# Altium project ESP32-WIRELESS.PrjPcb
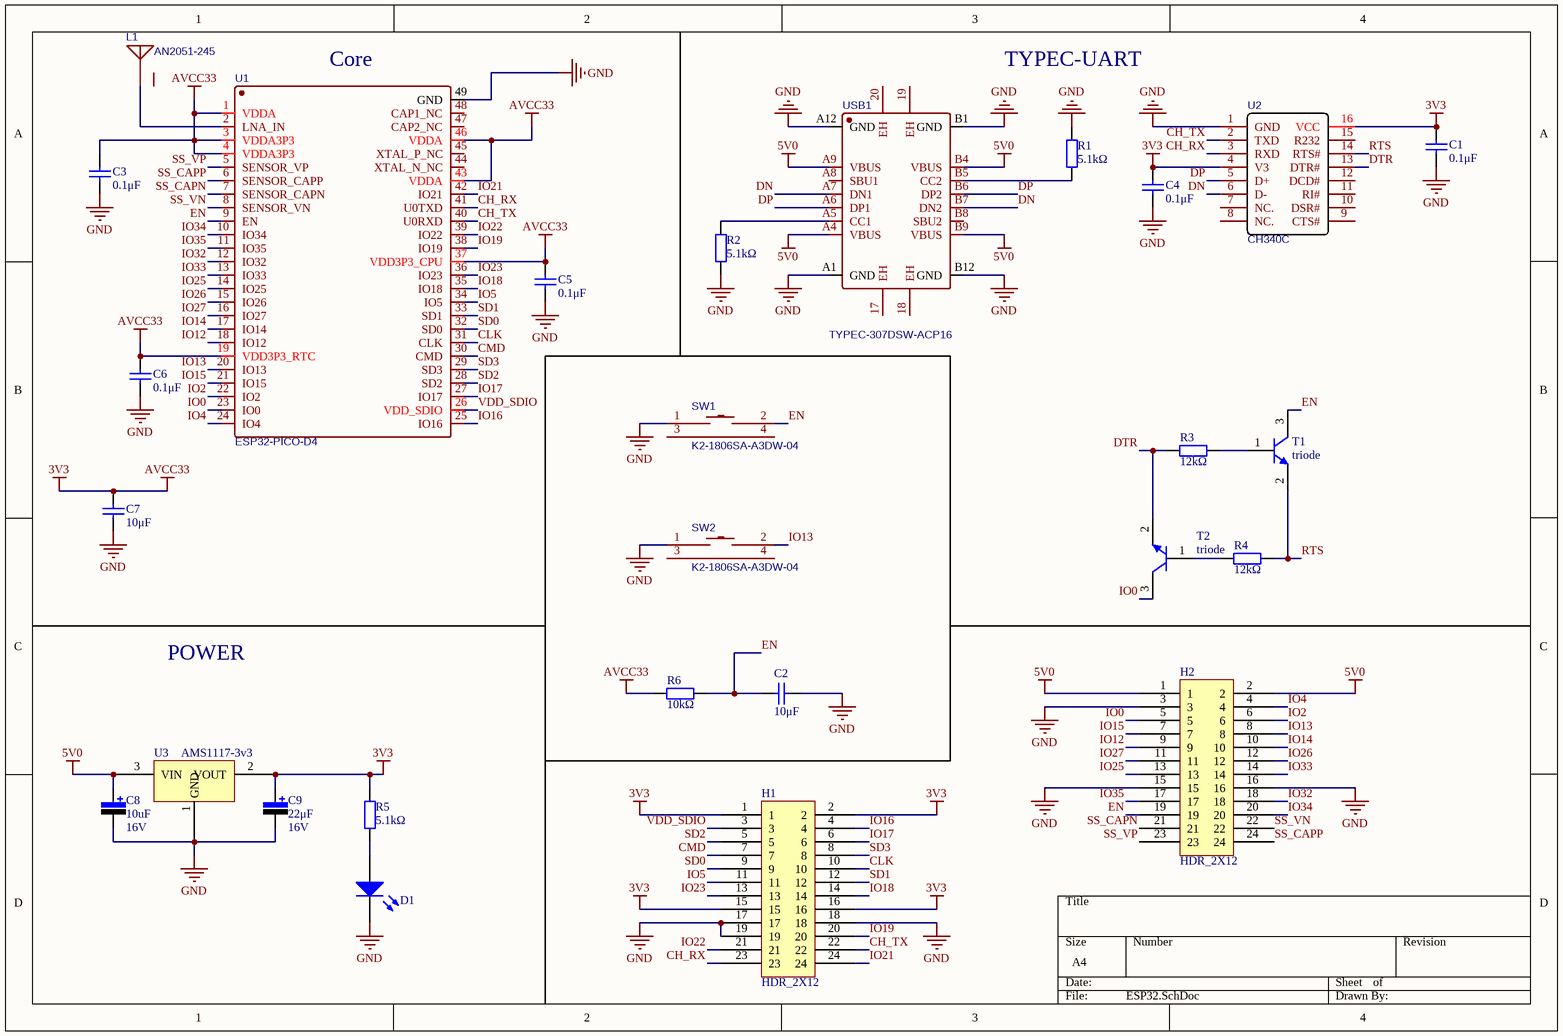
[diagram p0: ESP32.SchDoc]
1 sheet, 27 parts. Net scope: global (net labels, ports and power ports of the same name join across sheets).
Board file: ESP32.PcbDoc

## Sheet ESP32.SchDoc
size A4

### Parts
C1  value 0.1μF  [0603-C]  (hidden comment: Cap)
C2  value 10μF  [0603-C]  (hidden comment: Cap)
C3  value 0.1μF  [0603-C]  (hidden comment: Cap)
C4  value 0.1μF  [0603-C]  (hidden comment: Cap)
C5  value 0.1μF  [0603-C]  (hidden comment: Cap)
C6  value 0.1μF  [0603-C]  (hidden comment: Cap)
C7  value 10μF  [0603-C]  (hidden comment: Cap)
C8  value 10uF  Vol: 16V  [CAP-3528]  (hidden comment: Cap Pol)
C9  value 22μF  Vol: 16V  [CAP-3528]  (hidden comment: Cap Pol)
D1  LED0  [LED_0805]  (value not drawn)
H1  HDR_2X12  [HDR_2X12]
H2  HDR_2X12  [HDR_2X12]
L1  AN2051-245  [ANT2051]
R1  value 5.1kΩ  [0603_R]  (hidden comment: Res2)
R2  value 5.1kΩ  [0603_R]  (hidden comment: Res2)
R3  value 12kΩ  [0603_R]  (hidden comment: Res2)
R4  value 12kΩ  [0603_R]  (hidden comment: Res2)
R5  value 5.1kΩ  [0603_R]  (hidden comment: Res2)
R6  value 10kΩ  [0603_R]  (hidden comment: Res2)
SW1  K2-1806SA-A3DW-04  [KEY-SMD_K2-1806SA-AXXW-XX]
SW2  K2-1806SA-A3DW-04  [KEY-SMD_K2-1806SA-AXXW-XX]
T1  triode  [SOT-23-3三极管贴片]
T2  triode  [SOT-23-3三极管贴片]
U1  ESP32-PICO-D4  [QFN-48_L7.0-W7.0-P0.50-BL-EP5.4]
U2  CH340C  [SOP-16_L10.0-W3.9-P1.27-LS6.0-BL]
U3  AMS1117-3v3  [SOT-223]
USB1  TYPEC-307DSW-ACP16  [USB-C-SMD_TYPEC-307DSW-ACP16]

### Nets
3V3: C1.1 C3.1 C4.1 C5.1 C6.1 C7.1 C9.1 H1.1 H1.2 H1.15 H1.16 R5.2 R6.1 U1.1(VDDA) U1.3(VDDA3P3) U1.4(VDDA3P3) U1.19(VDD3P3_RTC) U1.37(VDD3P3_CPU) U1.43(VDDA) U1.46(VDDA) U2.4(V3) U2.16(VCC) U3.2(VOUT)  [also labelled AVCC33]
5V0: C8.1 H2.1 H2.2 U3.3(VIN) USB1.A4(VBUS) USB1.A9(VBUS) USB1.B4(VBUS) USB1.B9(VBUS)
GND: C1.2 C2.2 C3.2 C4.2 C5.2 C6.2 C7.2 C8.2 C9.2 D1.2(K) H1.17 H1.18 H1.19 H2.3 H2.15 H2.16 R1.1 R2.2 SW1.1 SW2.1 U1.49(GND) U2.1(GND) U3.1(GND) USB1.A1(GND) USB1.A12(GND) USB1.B1(GND) USB1.B12(GND)
CH_RX: H1.23 U1.41(U0TXD) U2.3(RXD)
CH_TX: H1.22 U1.40(U0RXD) U2.2(TXD)
CLK: H1.10 U1.31(CLK)
CMD: H1.7 U1.30(CMD)
DN: U2.6(D-) USB1.A7(DN1) USB1.B7(DN2)
DP: U2.5(D+) USB1.A6(DP1) USB1.B6(DP2)
DTR: R3.1 T2.2(E) U2.13(DTR#)
EN: C2.1 H2.19 R6.2 SW1.2 T1.3(C) U1.9(EN)
IO0: H2.5 T2.3(C) U1.23(IO0)
IO2: H2.6 U1.22(IO2)
IO4: H2.4 U1.24(IO4)
IO5: H1.11 U1.34(IO5)
IO12: H2.9 U1.18(IO12)
IO13: H2.8 SW2.2 U1.20(IO13)
IO14: H2.10 U1.17(IO14)
IO15: H2.7 U1.21(IO15)
IO16: H1.4 U1.25(IO16)
IO17: H1.6 U1.27(IO17)
IO18: H1.14 U1.35(IO18)
IO19: H1.20 U1.38(IO19)
IO21: H1.24 U1.42(IO21)
IO22: H1.21 U1.39(IO22)
IO23: H1.13 U1.36(IO23)
IO25: H2.13 U1.14(IO25)
IO26: H2.12 U1.15(IO26)
IO27: H2.11 U1.16(IO27)
IO32: H2.18 U1.12(IO32)
IO33: H2.14 U1.13(IO33)
IO34: H2.20 U1.10(IO34)
IO35: H2.17 U1.11(IO35)
RTS: R4.2 T1.2(E) U2.14(RTS#)
SD0: H1.9 U1.32(SD0)
SD1: H1.12 U1.33(SD1)
SD2: H1.5 U1.28(SD2)
SD3: H1.8 U1.29(SD3)
SS_CAPN: H2.21 U1.7(SENSOR_CAPN)
SS_CAPP: H2.24 U1.6(SENSOR_CAPP)
SS_VN: H2.22 U1.8(SENSOR_VN)
SS_VP: H2.23 U1.5(SENSOR_VP)
VDD_SDIO: H1.3 U1.26(VDD_SDIO)
NetD1_1: D1.1(A) R5.1
NetL1_1: L1.1(ANT) U1.2(LNA_IN)
NetR1_2: R1.2 USB1.B5(CC2)
NetR2_1: R2.1 USB1.A5(CC1)
NetR3_2: R3.2 T1.1(B)
NetR4_1: R4.1 T2.1(B)

Not connected (* = marked no-connect by the designer): L1 2; SW1 3 4; SW2 3 4; U1 44(XTAL_N_NC) 45(XTAL_P_NC) 47(CAP2_NC) 48(CAP1_NC); U2 7(NC.) 8(NC.) 9(CTS#) 10(DSR#) 11(RI#) 12(DCD#) 15(R232); USB1 17(EH) 18(EH) 19(EH) 20(EH) A8(SBU1) B8(SBU2)

### Notes on the sheet
- (near U1) Core
- TYPEC-UART
- POWER

### Library data of the parts
C1-C7 = Cap: 无极性电容; Published: 8-Jun-2000; LatestRevisionDate: 17-Jul-2002; LatestRevisionNote: Re-released for DXP Platform.; PackageReference: RAD-0.3; Publisher: Altium Limited
C8 C9 = Cap Pol: 极性电容; Published: 8-Jun-2000; LatestRevisionDate: 17-Jul-2002; LatestRevisionNote: Re-released for DXP Platform.; PackageReference: RB7.6-15; Publisher: Altium Limited
D1 = LED0: 发光二极管; Published: 8-Jun-2000; LatestRevisionDate: 08-Jul-2005; LatestRevisionNote: Mech Layer 1 removed.; PackageReference: LED-0; Publisher: Altium Limited
L1 = AN2051-245: BOM_Manufacturer: Rainsun; BOM_Supplier: LCSC; BOM_Manufacturer Part: AN2051-245; BOM_Supplier Part: C99727; BOM_JLCPCB Part Class: Extended Part; spicePre: L; spiceSymbolName: AN2051-245
R1-R6 = Res: Resistor; Published: 8-Jun-2000; LatestRevisionDate: 17-Jul-2002; LatestRevisionNote: Re-released for DXP Platform.; PackageReference: AXIAL-0.4; Publisher: Altium Limited; PackageDescription: Axial Device, Thru-Hole; 2 Leads; 0.4 in Pin Spacing
SW1 SW2 = K2-1806SA-A3DW-04: BOM_Manufacturer: 韩国韩荣; Contributor: LCSC; BOM_Supplier: LCSC; BOM_Supplier Part: C2690015; BOM_Manufacturer Part: K2-1806SA-A3DW-04; BOM_JLCPCB Part Class: Extended Part; spicePre: S; spiceSymbolName: K2-1806SA-A3DW-04
T1 T2 = triode: NPN
U1 = ESP32-PICO-D4: BOM_Manufacturer: Espressif Systems; Contributor: LCSC; BOM_Supplier: LCSC; BOM_Supplier Part: C193707; BOM_Manufacturer Part: ESP32-PICO-D4; BOM_JLCPCB Part Class: Extended Part; spicePre: U; spiceSymbolName: ESP32-PICO-D4
U2 = CH340C: BOM_Manufacturer: WCH; BOM_Supplier: LCSC; BOM_Manufacturer Part: CH340C; BOM_Supplier Part: C84681; BOM_JLCPCB Part Class: Extended Part; spicePre: U; spiceSymbolName: CH340C
USB1 = TYPEC-307DSW-ACP16: BOM_Manufacturer: XUNPU(讯普); Contributor: LCSC; BOM_Supplier: LCSC; BOM_Supplier Part: C2840402; BOM_Manufacturer Part: TYPEC-307DSW-ACP16; spicePre: U; spiceSymbolName: TYPEC-307DSW-ACP16